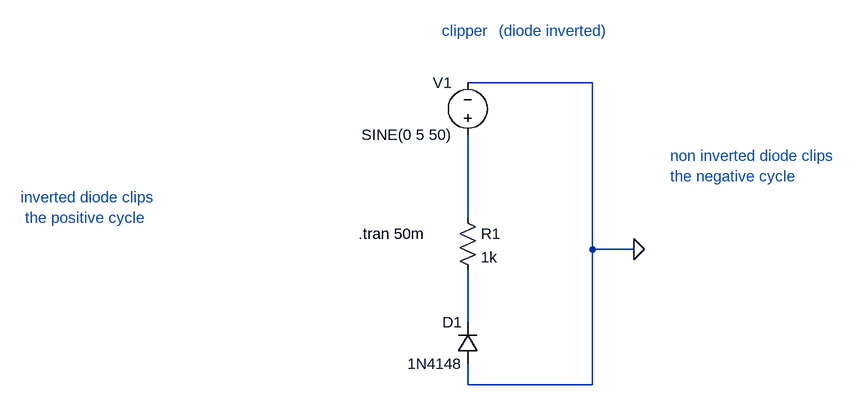
[diagram p0: schematic clipper.asc]
clipper.asc, the LTspice schematic file:
Version 4.1
SHEET 1 880 680
WIRE 352 -208 160 -208
WIRE 160 0 160 -128
WIRE 352 48 352 -208
WIRE 416 48 352 48
WIRE 160 160 160 80
WIRE 160 256 160 224
WIRE 352 256 352 48
WIRE 352 256 160 256
FLAG 416 48 0
SYMBOL voltage 160 -112 R180
WINDOW 0 24 96 Left 2
WINDOW 3 24 16 Left 2
WINDOW 123 0 0 Left 0
WINDOW 39 0 0 Left 0
SYMATTR InstName V1
SYMATTR Value SINE(0 5 50)
SYMBOL diode 176 224 R180
WINDOW 0 24 64 Left 2
WINDOW 3 24 0 Left 2
SYMATTR InstName D1
SYMATTR Value 1N4148
SYMBOL res 144 -16 R0
SYMATTR InstName R1
SYMATTR Value 1k
TEXT -8 24 Left 2 !.tran 50m
TEXT 120 -288 Left 2 ;clipper
TEXT 208 -288 Left 2 ;(diode inverted)
TEXT -528 -32 Left 2 ;inverted diode clips\n the positive cycle
TEXT 472 -96 Left 2 ;non inverted diode clips\nthe negative cycle

The netlist it stands for:
* clipper.asc
V1 N001 0 SINE(0 5 50)
D1 0 N002 1N4148
R1 N001 N002 1k
.model D D
.lib standard.dio
.tran 50m
* clipper
* (diode inverted)
* inverted diode clips
*  the positive cycle
* non inverted diode clips
* the negative cycle
.backanno
.end